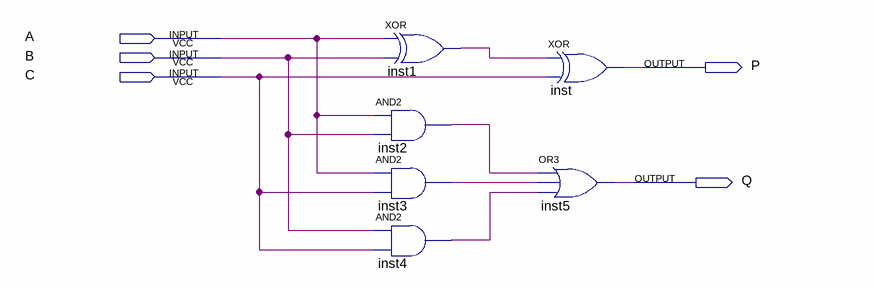
[diagram p0: schematic sheet]
// Quartus schematic PreLab.bdf as structural Verilog: 6 symbols, 5 pins
module PreLab (
  input  A,
  input  B,
  input  C,
  output P,
  output Q
);

  wire inst1_out, inst2_out, inst3_out, inst4_out;

  xor inst1 (inst1_out, A, B);
  and inst2 (inst2_out, A, B);
  and inst3 (inst3_out, A, C);
  and inst4 (inst4_out, B, C);
  xor inst (P, inst1_out, C);
  or inst5 (Q, inst2_out, inst3_out, inst4_out);
endmodule
